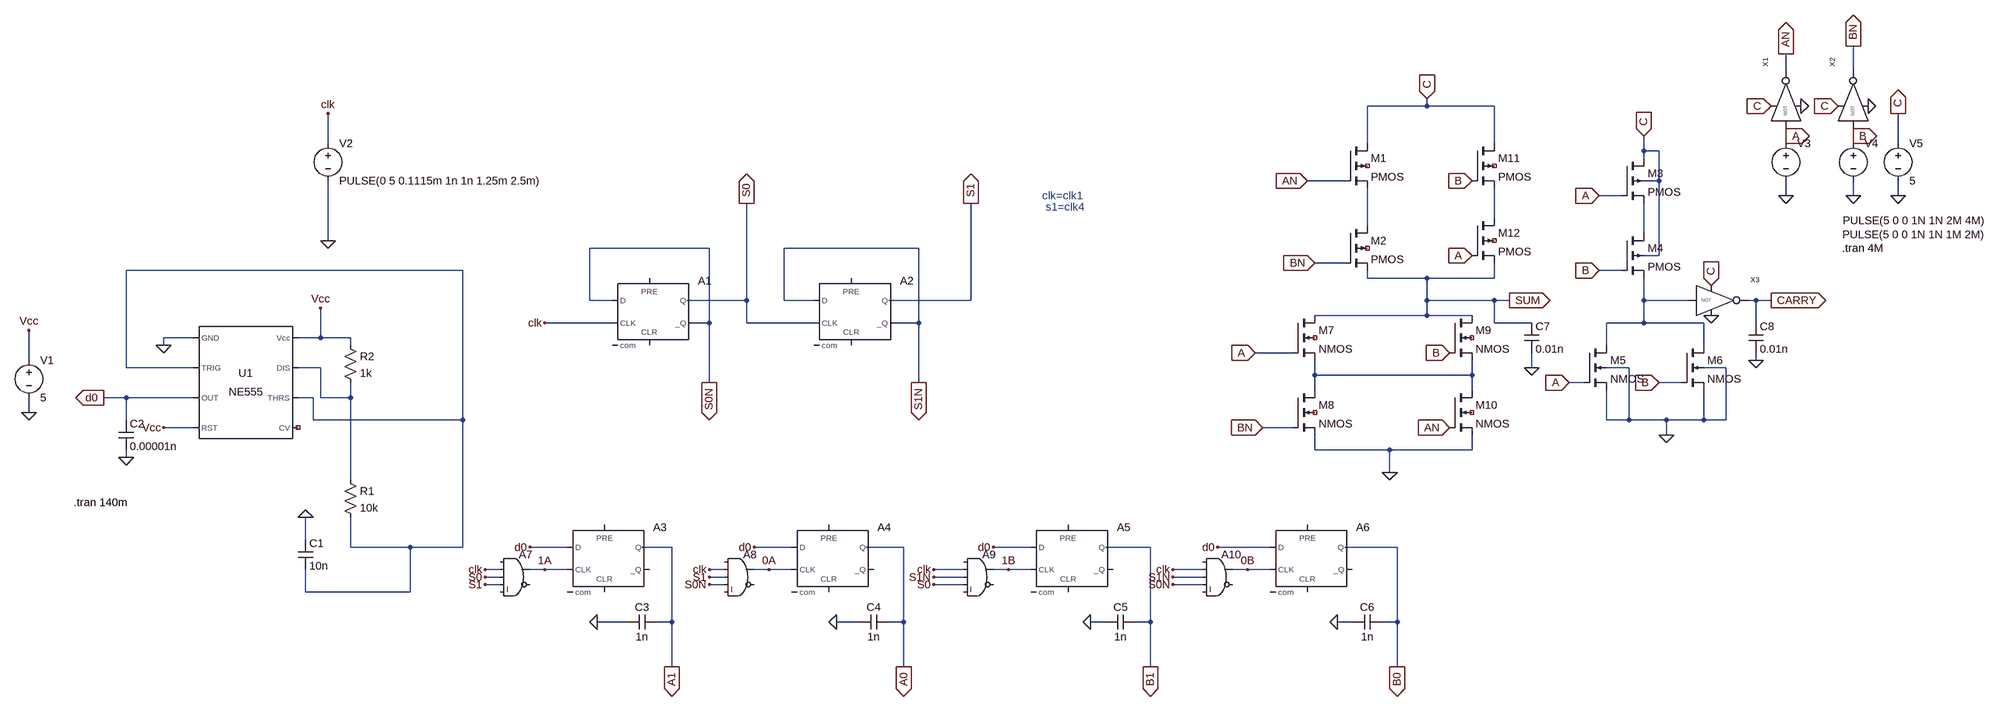
[diagram p0: schematic Draft40.asc]
Draft40.asc, the LTspice schematic file:
Version 4
SHEET 1 2536 940
WIRE 2096 -432 2096 -464
WIRE 2240 -432 2240 -480
WIRE 1328 -352 1328 -368
WIRE 1328 -352 1200 -352
WIRE 1472 -352 1328 -352
WIRE 2096 -288 2096 -304
WIRE 2240 -288 2240 -304
WIRE -1024 -272 -1024 -336
WIRE 1200 -272 1200 -352
WIRE 1472 -272 1472 -352
WIRE 2096 -272 2096 -288
WIRE 2240 -272 2240 -288
WIRE 2336 -272 2336 -336
WIRE 1792 -256 1792 -288
WIRE 1824 -256 1792 -256
WIRE 1792 -240 1792 -256
WIRE 1152 -192 1072 -192
WIRE 1824 -192 1824 -256
WIRE 1824 -192 1792 -192
WIRE 1744 -160 1696 -160
WIRE 2096 -160 2096 -192
WIRE 2240 -160 2240 -192
WIRE 2336 -160 2336 -192
WIRE 1472 -112 1472 -176
WIRE 1200 -96 1200 -176
WIRE 1792 -80 1792 -144
WIRE -1024 -64 -1024 -192
WIRE -208 -48 -464 -48
WIRE 240 -48 -48 -48
WIRE 1824 -32 1824 -192
WIRE 1824 -32 1792 -32
WIRE 1152 -16 1088 -16
WIRE -736 0 -1456 0
WIRE 1744 0 1696 0
WIRE 1200 16 1200 0
WIRE 1328 16 1200 16
WIRE 1472 16 1472 -16
WIRE 1472 16 1328 16
WIRE -464 64 -464 -48
WIRE -416 64 -464 64
WIRE -128 64 -128 -144
WIRE -128 64 -256 64
WIRE -48 64 -48 -48
WIRE 16 64 -48 64
WIRE 352 64 352 -144
WIRE 352 64 176 64
WIRE 1328 64 1328 16
WIRE 1472 64 1328 64
WIRE 1504 64 1472 64
WIRE 1792 64 1792 16
WIRE 1888 64 1792 64
WIRE 2032 64 2016 64
WIRE 2064 64 2032 64
WIRE 1328 96 1328 64
WIRE 1328 96 1088 96
WIRE 1424 96 1328 96
WIRE -416 112 -560 112
WIRE -208 112 -208 -48
WIRE -208 112 -240 112
WIRE -128 112 -128 64
WIRE 16 112 -128 112
WIRE 240 112 240 -48
WIRE 240 112 192 112
WIRE 1472 112 1472 64
WIRE 1552 112 1472 112
WIRE 1792 112 1792 64
WIRE 1792 112 1712 112
WIRE 1920 112 1792 112
WIRE 2032 112 2032 64
WIRE -1312 144 -1376 144
WIRE -1040 144 -1040 80
WIRE -1040 144 -1088 144
WIRE -976 144 -1040 144
WIRE -1376 160 -1376 144
WIRE -976 160 -976 144
WIRE 1712 160 1712 112
WIRE 1920 160 1920 112
WIRE 1040 176 960 176
WIRE -1664 192 -1664 128
WIRE 2032 192 2032 176
WIRE -1456 208 -1456 0
WIRE -1312 208 -1456 208
WIRE -1040 208 -1088 208
WIRE 1552 208 1552 176
WIRE 1760 208 1712 208
WIRE 1968 208 1920 208
WIRE 1088 224 1088 192
WIRE 1424 224 1424 192
WIRE 1424 224 1088 224
WIRE -208 240 -208 112
WIRE 240 240 240 112
WIRE 1664 240 1632 240
WIRE 1872 240 1824 240
WIRE 1088 256 1088 224
WIRE 1424 256 1424 224
WIRE -1456 272 -1504 272
WIRE -1312 272 -1456 272
WIRE -1056 272 -1088 272
WIRE -1040 272 -1040 208
WIRE -976 272 -976 240
WIRE -976 272 -1040 272
WIRE -1664 304 -1664 272
WIRE -1456 320 -1456 272
WIRE -1056 320 -1056 272
WIRE -736 320 -736 0
WIRE -736 320 -1056 320
WIRE 1712 320 1712 256
WIRE 1760 320 1760 208
WIRE 1760 320 1712 320
WIRE 1840 320 1760 320
WIRE 1920 320 1920 256
WIRE 1920 320 1840 320
WIRE 1968 320 1968 208
WIRE 1968 320 1920 320
WIRE -1312 336 -1376 336
WIRE 1040 336 976 336
WIRE 1840 352 1840 320
WIRE 1088 384 1088 352
WIRE 1248 384 1088 384
WIRE 1424 384 1424 352
WIRE 1424 384 1248 384
WIRE -1456 400 -1456 384
WIRE 1248 432 1248 384
WIRE -976 448 -976 272
WIRE -1072 576 -1072 528
WIRE -976 592 -976 528
WIRE -848 592 -976 592
WIRE -736 592 -736 320
WIRE -736 592 -848 592
WIRE -512 592 -592 592
WIRE -288 592 -352 592
WIRE -32 592 -112 592
WIRE 208 592 128 592
WIRE 480 592 400 592
WIRE 736 592 640 592
WIRE 992 592 880 592
WIRE 1264 592 1152 592
WIRE -656 640 -688 640
WIRE -560 640 -592 640
WIRE -512 640 -560 640
WIRE -176 640 -208 640
WIRE -80 640 -112 640
WIRE -32 640 -80 640
WIRE 336 640 272 640
WIRE 432 640 400 640
WIRE 480 640 432 640
WIRE 848 640 784 640
WIRE 944 640 912 640
WIRE 992 640 944 640
WIRE -656 656 -688 656
WIRE -176 656 -208 656
WIRE 336 656 272 656
WIRE 848 656 784 656
WIRE -656 672 -688 672
WIRE -176 672 -208 672
WIRE 336 672 272 672
WIRE 848 672 784 672
WIRE -1072 688 -1072 640
WIRE -848 688 -848 592
WIRE -848 688 -1072 688
WIRE -384 752 -448 752
WIRE -288 752 -288 592
WIRE -288 752 -320 752
WIRE 112 752 64 752
WIRE 208 752 208 592
WIRE 208 752 176 752
WIRE 640 752 608 752
WIRE 736 752 736 592
WIRE 736 752 704 752
WIRE 1168 752 1136 752
WIRE 1264 752 1264 592
WIRE 1264 752 1232 752
WIRE -288 848 -288 752
WIRE 208 848 208 752
WIRE 736 848 736 752
WIRE 1264 848 1264 752
FLAG -560 112 clk
FLAG -128 -144 S0
IOPIN -128 -144 Out
FLAG -208 240 S0N
IOPIN -208 240 Out
FLAG 352 -144 S1
IOPIN 352 -144 Out
FLAG 240 240 S1N
IOPIN 240 240 Out
FLAG -592 592 d0
FLAG -112 592 d0
FLAG 400 592 d0
FLAG 880 592 d0
FLAG -688 640 clk
FLAG -208 640 clk
FLAG 272 640 clk
FLAG 784 640 clk
FLAG -688 656 S0
FLAG -688 672 S1
FLAG -208 656 S1
FLAG 272 672 S0
FLAG -288 848 A1
IOPIN -288 848 Out
FLAG 1264 848 B0
IOPIN 1264 848 Out
FLAG -208 672 S0N
FLAG 272 656 S1N
FLAG 784 656 S1N
FLAG 784 672 S0N
FLAG 208 848 A0
IOPIN 208 848 Out
FLAG 736 848 B1
IOPIN 736 848 Out
FLAG -1376 160 0
FLAG -1040 80 Vcc
FLAG -1376 336 Vcc
FLAG -1072 528 0
FLAG -1664 128 Vcc
FLAG -1664 304 0
FLAG -1504 272 d0
IOPIN -1504 272 Out
FLAG -1456 400 0
FLAG -1024 -64 0
FLAG -1024 -336 clk
FLAG -448 752 0
FLAG 64 752 0
FLAG 608 752 0
FLAG 1136 752 0
FLAG -560 640 1A
FLAG -80 640 0A
FLAG 432 640 1B
FLAG 944 640 0B
FLAG 2336 -336 C
IOPIN 2336 -336 Out
FLAG 2336 -160 0
FLAG 2240 -160 0
FLAG 2096 -160 0
FLAG 1072 -192 AN
IOPIN 1072 -192 In
FLAG 1376 176 B
IOPIN 1376 176 In
FLAG 960 176 A
IOPIN 960 176 In
FLAG 1088 -16 BN
IOPIN 1088 -16 In
FLAG 1328 -368 C
IOPIN 1328 -368 In
FLAG 2272 -352 0
FLAG 2128 -352 0
FLAG 2096 -464 AN
IOPIN 2096 -464 Out
FLAG 2240 -480 BN
IOPIN 2240 -480 Out
FLAG 2208 -352 C
IOPIN 2208 -352 In
FLAG 2064 -352 C
IOPIN 2064 -352 In
FLAG 1424 -192 B
IOPIN 1424 -192 In
FLAG 1424 -32 A
IOPIN 1424 -32 In
FLAG 976 336 BN
IOPIN 976 336 In
FLAG 2096 -288 A
IOPIN 2096 -288 Out
FLAG 2240 -288 B
IOPIN 2240 -288 Out
FLAG 1504 64 SUM
IOPIN 1504 64 Out
FLAG 1248 432 0
FLAG 1840 352 0
FLAG 1824 240 B
IOPIN 1824 240 In
FLAG 1632 240 A
IOPIN 1632 240 In
FLAG 1696 0 B
IOPIN 1696 0 In
FLAG 1696 -160 A
IOPIN 1696 -160 In
FLAG 1792 -288 C
IOPIN 1792 -288 In
FLAG 2064 64 CARRY
IOPIN 2064 64 Out
FLAG 1936 96 0
FLAG 1936 32 C
IOPIN 1936 32 In
FLAG 1376 336 AN
IOPIN 1376 336 In
FLAG 1552 208 0
FLAG 2032 192 0
SYMBOL Digital\\dflop -336 16 R0
SYMATTR InstName A1
SYMBOL Digital\\dflop 96 16 R0
SYMATTR InstName A2
SYMBOL Digital\\dflop -432 544 R0
SYMATTR InstName A3
SYMBOL Digital\\dflop 48 544 R0
SYMATTR InstName A4
SYMBOL Digital\\dflop 560 544 R0
SYMATTR InstName A5
SYMBOL Digital\\dflop 1072 544 R0
SYMATTR InstName A6
SYMBOL Digital\\and -624 592 R0
SYMATTR InstName A7
SYMBOL Digital\\and -144 592 R0
SYMATTR InstName A8
SYMBOL Digital\\and 368 592 R0
SYMATTR InstName A9
SYMBOL Digital\\and 880 592 R0
SYMATTR InstName A10
SYMBOL Misc\\NE555 -1200 240 R0
SYMATTR InstName U1
SYMBOL res -992 432 R0
SYMATTR InstName R1
SYMATTR Value 10k
SYMBOL res -992 144 R0
SYMATTR InstName R2
SYMATTR Value 1k
SYMBOL cap -1088 576 R0
SYMATTR InstName C1
SYMATTR Value 10n
SYMBOL voltage -1664 176 R0
WINDOW 123 0 0 Left 0
WINDOW 39 0 0 Left 0
SYMATTR InstName V1
SYMATTR Value 5
SYMBOL cap -1472 320 R0
SYMATTR InstName C2
SYMATTR Value 0.00001n
SYMBOL voltage -1024 -288 R0
WINDOW 123 0 0 Left 0
WINDOW 39 0 0 Left 0
SYMATTR InstName V2
SYMATTR Value PULSE(0 5 0.1115m 1n 1n 1.25m 2.5m)
SYMBOL cap -320 736 R90
WINDOW 0 0 32 VBottom 2
WINDOW 3 32 32 VTop 2
SYMATTR InstName C3
SYMATTR Value 1n
SYMBOL cap 176 736 R90
WINDOW 0 0 32 VBottom 2
WINDOW 3 32 32 VTop 2
SYMATTR InstName C4
SYMATTR Value 1n
SYMBOL cap 704 736 R90
WINDOW 0 0 32 VBottom 2
WINDOW 3 32 32 VTop 2
SYMATTR InstName C5
SYMATTR Value 1n
SYMBOL cap 1232 736 R90
WINDOW 0 0 32 VBottom 2
WINDOW 3 32 32 VTop 2
SYMATTR InstName C6
SYMATTR Value 1n
SYMBOL voltage 2096 -288 R0
WINDOW 3 122 181 Left 2
WINDOW 123 0 0 Left 0
WINDOW 39 0 0 Left 0
SYMATTR Value PULSE(5 0 0 1N 1N 2M 4M)
SYMATTR InstName V3
SYMBOL voltage 2240 -288 R0
WINDOW 3 -23 211 Left 2
WINDOW 123 0 0 Left 0
WINDOW 39 0 0 Left 0
SYMATTR Value PULSE(5 0 0 1N 1N 1M 2M)
SYMATTR InstName V4
SYMBOL voltage 2336 -288 R0
WINDOW 123 0 0 Left 0
WINDOW 39 0 0 Left 0
SYMATTR InstName V5
SYMATTR Value 5
SYMBOL NOT4 2112 -368 R270
SYMATTR InstName X1
SYMBOL NOT4 2256 -368 R270
SYMATTR InstName X2
SYMBOL pmos4 1152 -272 R0
SYMATTR InstName M1
SYMBOL pmos4 1152 -96 R0
SYMATTR InstName M2
SYMBOL pmos4 1744 -240 R0
SYMATTR InstName M3
SYMBOL pmos4 1744 -80 R0
SYMATTR InstName M4
SYMBOL nmos4 1664 160 R0
SYMATTR InstName M5
SYMBOL nmos4 1872 160 R0
SYMATTR InstName M6
SYMBOL NOT4 1952 80 R0
SYMATTR InstName X3
SYMBOL nmos4 1040 96 R0
SYMATTR InstName M7
SYMBOL nmos4 1040 256 R0
SYMATTR InstName M8
SYMBOL nmos4 1376 96 R0
SYMATTR InstName M9
SYMBOL nmos4 1376 256 R0
SYMATTR InstName M10
SYMBOL pmos4 1424 -272 R0
SYMATTR InstName M11
SYMBOL pmos4 1424 -112 R0
SYMATTR InstName M12
SYMBOL cap 1536 112 R0
SYMATTR InstName C7
SYMATTR Value 0.01n
SYMBOL cap 2016 112 R0
SYMATTR InstName C8
SYMATTR Value 0.01n
TEXT -1568 496 Left 2 !.tran 140m
TEXT 504 -160 Left 2 ;clk=clk1
TEXT 512 -136 Left 2 ;s1=clk4
TEXT 2216 -48 Left 2 !.tran 4M

The netlist it stands for:
* Draft40.asc
A1 S0N 0 clk 0 0 S0N S0 0 DFLOP
A2 S1N 0 S0 0 0 S1N S1 0 DFLOP
A3 d0 0 1A 0 0 0 A1 0 DFLOP
A4 d0 0 0A 0 0 0 A0 0 DFLOP
A5 d0 0 1B 0 0 0 B1 0 DFLOP
A6 d0 0 0B 0 0 0 B0 0 DFLOP
A7 0 clk S0 S1 0 0 1A 0 AND
A8 0 clk S1 S0N 0 0 0A 0 AND
A9 0 clk S1N S0 0 0 1B 0 AND
A10 0 clk S1N S0N 0 0 0B 0 AND
XU1 0 N004 d0 Vcc NC_01 N004 N006 Vcc NE555  ; pins GND TRIG OUT RST CV THRS DIS Vcc
R1 N006 N004 10k
R2 Vcc N006 1k
C1 0 N004 10n
V1 Vcc 0 5
C2 d0 0 0.00001n
V2 clk 0 PULSE(0 5 0.1115m 1n 1n 1.25m 2.5m)
C3 A1 0 1n
C4 A0 0 1n
C5 B1 0 1n
C6 B0 0 1n
V3 A 0 PULSE(5 0 0 1N 1N 2M 4M)
V4 B 0 PULSE(5 0 0 1N 1N 1M 2M)
V5 C 0 5
XX1 A C 0 AN NOT4  ; pins A VH VL OUT
XX2 B C 0 BN NOT4  ; pins A VH VL OUT
M1 C AN N002 NC_02 PMOS
M2 N002 BN SUM NC_03 PMOS
M3 C A N003 C PMOS
M4 N003 B N005 C PMOS
M5 N005 A 0 0 NMOS
M6 N005 B 0 0 NMOS
XX3 N005 C 0 CARRY NOT4  ; pins A VH VL OUT
M7 SUM A N007 NC_04 NMOS
M8 N007 BN 0 NC_05 NMOS
M9 SUM B N007 NC_06 NMOS
M10 N007 AN 0 NC_07 NMOS
M11 C B N001 NC_08 PMOS
M12 N001 A SUM NC_09 PMOS
C7 SUM 0 0.01n
C8 CARRY 0 0.01n
.model NMOS NMOS
.model PMOS PMOS
.lib standard.mos
.tran 140m
* clk=clk1
* s1=clk4
.tran 4M
.lib NE555.sub
.backanno
.end